# EasyEDA Pro project pcb_design.epro, board 控制板
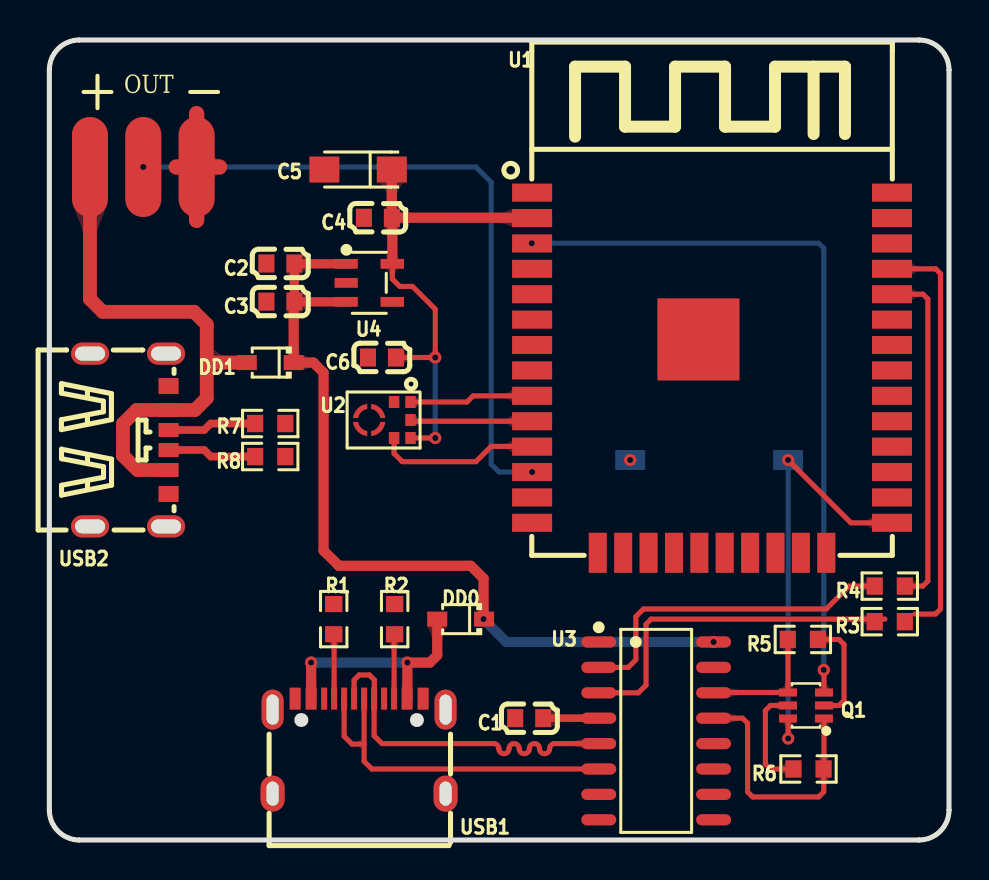
[diagram p2: board, top side]
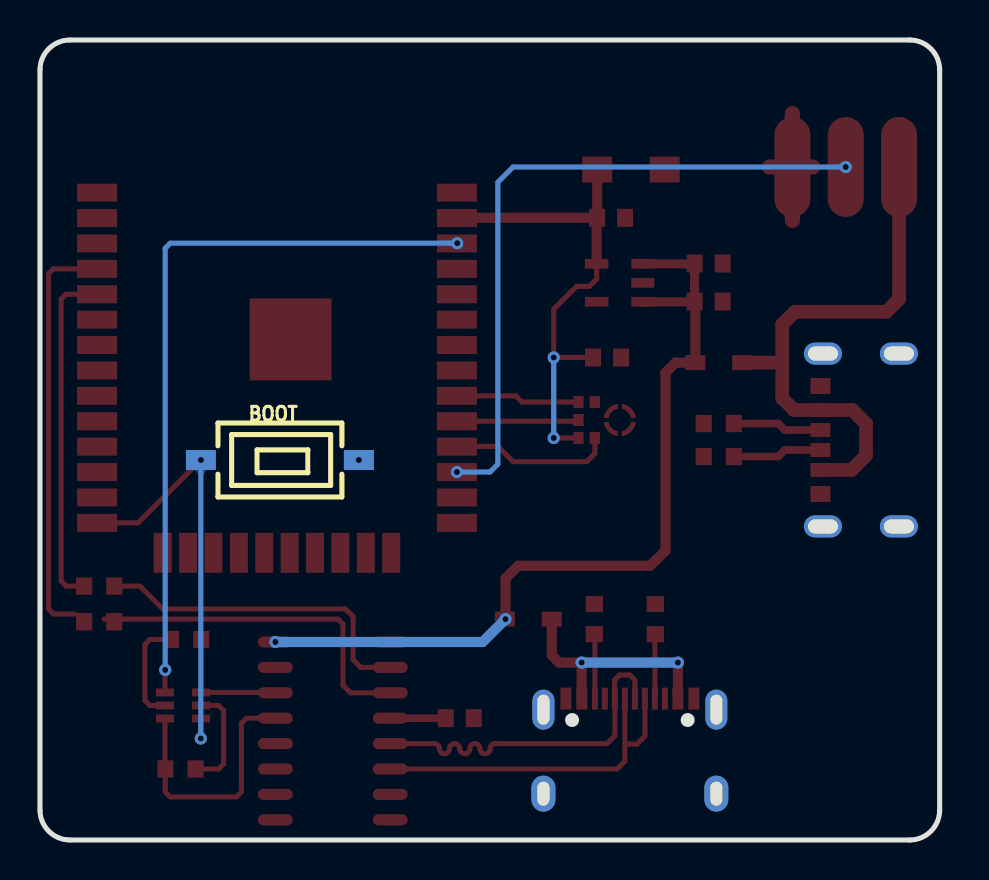
[diagram p3: board, bottom side, seen from below]

Outline 45 x 40 mm; copper layers: Top Layer, Bottom Layer. Coordinates in mm from the lower left corner of the outline.
Outline path: 0,38.5 0,1.5 arc(0.44,0.44) 1.5,0 43.5,0 arc(44.56,0.44) 45,1.5 45,38.5 arc(44.56,39.56) 43.5,40 1.5,40 arc(0.44,39.56) 0,38.5
Stack: Top Layer 0.035mm / Dielectric1 1.51mm FR4 er 4.5 / Bottom Layer 0.035mm

## Design rules (mm)
net D+: DP1
net D-: DP1
template: JLCPCB Capability(Two Layers Board)
spacing copperThickness1oz (default): track to track 0.102, other pairs 0.152 to 0.3
spacing copperThickness2oz: track to track 0.203, other pairs 0.152 to 0.3
track width copperThickness1oz (default): min 0.127, default 0.254, max 2.54
track width copperThickness2oz: min 0.203, default 0.254, max 2.54
differential pair differentialPair (default): width min 0.127, default 0.254, max 2.54; gap min 0.152, default 0.152
via viaSize (default): diameter min 0.5, default 0.61, max 10; hole min 0.3, default 0.305, max 6.3

## Placement (name value [footprint] x y rotation side)
BOOT  TS-1092S-B3D2-G  [SW-SMD_L6.1-W3.6-LS7.9]  33 19 0 bottom
C1  100nF  [C0603]  24 6.09 180 top
C2  1uF  [C0603]  11.56 28.82 0 top
C3  100nF  [C0603]  11.56 26.92 0 top
C4  100nF  [C0603]  16.43 31.11 0 top
C5  10uF  [CAP-SMD_L3.2-W1.6-RD]  15.44 33.52 180 top
C6  100nF  [C0603]  16.64 24.12 0 top
DD0  1N5819WS  [SOD-323_L1.8-W1.3-LS2.5-RD]  20.57 11.04 180 top
DD1  1N5819WS  [SOD-323_L1.8-W1.3-LS2.5-RD]  11.05 23.87 180 top
NOREF  -  [Pad_e70]  7.37 33.65 0 top
NOREF#2  -  [Pad_e33]  2.03 33.65 0 top
NOREF#3  -  [Pad_e47]  4.7 33.65 0 top
Q1  BC847BS  [SOT-363_L2.0-W1.3-P0.65-LS2.1-BR]  37.85 6.73 0 top
R1  5.1kΩ  [R0603]  14.22 11.04 90 top
R2  5.1kΩ  [R0603]  17.27 11.04 270 top
R3  100Ω  [R0603]  42.04 10.92 0 top
R4  100Ω  [R0603]  42.04 12.69 0 top
R5  10kΩ  [R0603]  37.69 10.03 0 top
R6  10kΩ  [R0603]  37.97 3.55 180 top
R7  5.1kΩ  [R0603]  11.05 20.82 180 top
R8  5.1kΩ  [R0603]  11.05 19.17 180 top
U1  ESP32-WROOM-32-N4  [WIFIM-SMD_ESP32-WROOM-32-N4]  33.15 23.36 0 top
U2  ICS-43434  [MIC-SMD_6P-L3.5-W2.7-P0.90-BL]  16.78 21 180 top
U3  CH340C  [SOP-16_L10.0-W3.9-P1.27-LS6.0-BL]  30.35 5.46 270 top
U4  SPX3819M5-L-3-3/TR  [SOT-23-5_L3.0-W1.7-P0.95-LS2.8-BL]  16 27.86 270 top
USB1  TYPE-C 16PIN 2MD(073)  [USB-C-SMD_TYPE-C-6PIN-2MD-073]  15.49 4.69 0 top
USB2  TYPE-C 6P(073)  [TYPE-C-SMD_TYPE-C-6P]  4 20 270 top

## Footprints (pads in the part's own frame, mm; a bottom-side part is the same pattern mirrored in y, then rotated)
C0603
  rect 0.8x0.9 smd: 1(-0.7,0) 2(0.7,0)
CAP-SMD_L3.2-W1.6-RD
  rect 1.5x1.296 smd: 1(-1.687,0) 2(1.687,0)
MIC-SMD_6P-L3.5-W2.7-P0.90-BL
  rect 0.52x0.6 smd: 1(-1.286,-0.9) 2(-0.465,-0.9) 4(-0.465,0.9) 5(-1.286,0.9) 6(-1.286,0)
  custom 0.709x0.71 smd: 3(0.276,-0.453) 3(0.329,0.505) 3(1.234,-0.505) 3(1.286,0.452)
Pad_e33
  oval 1.8x5 smd: 40(0,0)
Pad_e47
  oval 1.8x5 smd: 40(0,0)
Pad_e70
  oval 1.8x5 smd: 40(0,0)
R0603
  rect 0.806x0.864 smd: 1(-0.753,0) 2(0.753,0)
SOD-323_L1.8-W1.3-LS2.5-RD
  rect 1x0.75 smd: 1(-1.173,0) 2(1.173,0)
SOP-16_L10.0-W3.9-P1.27-LS6.0-BL
  oval 0.56x1.745 smd: 1(-4.445,-2.873) 2(-3.175,-2.873) 3(-1.905,-2.873) 4(-0.635,-2.873) 5(0.635,-2.873) 6(1.905,-2.873) 7(3.175,-2.873) 8(4.445,-2.873) 9(4.445,2.873) 10(3.175,2.873) 11(1.905,2.873) 12(0.635,2.873) 13(-0.635,2.873) 14(-1.905,2.873) 15(-3.175,2.873) 16(-4.445,2.873)
SOT-23-5_L3.0-W1.7-P0.95-LS2.8-BL
  rect 0.49x1.157 smd: 1(-0.95,-1.153) 2(0,-1.153) 3(0.95,-1.153)
  rect 0.49x1.175 smd: 4(0.95,1.153) 5(-0.95,1.153)
SOT-363_L2.0-W1.3-P0.65-LS2.1-BR
  rect 0.9x0.4 smd: 1(0.9,-0.65) 2(0.9,0) 3(0.9,0.65) 4(-0.9,0.65) 5(-0.9,0) 6(-0.9,-0.65)
SW-SMD_L6.1-W3.6-LS7.9
  rect 1.5x1 smd: 1(-3.95,0) 2(3.95,0)
TYPE-C-SMD_TYPE-C-6P
  oval 1.1x1.9 hole 0.7x1.5: 7(-4.32,1.837) 7(-4.32,-1.962) 7(4.32,1.837) 7(4.32,-1.962)
  rect 0.7x1 smd: A5(-0.5,1.962) A9(1.5,1.962) B5(0.5,1.962) B9(-1.5,1.962)
  rect 0.8x1 smd: A12(2.7,1.962) B12(-2.7,1.962)
USB-C-SMD_TYPE-C-6PIN-2MD-073
  rect 0.55x1.1 smd: 1(-3.2,2.375) 2(-2.4,2.375) 11(2.4,2.375) 12(3.2,2.375)
  rect 0.3x1.1 smd: 3(-1.75,2.375) 4(-1.25,2.375) 5(-0.75,2.375) 6(-0.25,2.375) 7(0.25,2.375) 8(0.75,2.375) 9(1.25,2.375) 10(1.75,2.375)
  oval 1.1x2 hole 0.6x1.5: 13(-4.325,1.825) 14(4.325,1.825)
  oval 1.2x1.8 hole 0.6x1.2: 13(-4.325,-2.375) 14(4.325,-2.375)
WIFIM-SMD_ESP32-WROOM-32-N4
  rect 2x0.9 smd: 1(-9,9.005) 2(-9,7.735) 3(-9,6.465) 4(-9,5.195) 5(-9,3.925) 6(-9,2.655) 7(-9,1.385) 8(-9,0.115) 9(-9,-1.155) 10(-9,-2.425) 11(-9,-3.695) 12(-9,-4.965) 13(-9,-6.235) 14(-9,-7.505) 25(9,-7.505) 26(9,-6.235) 27(9,-4.965) 28(9,-3.695) 29(9,-2.425) 30(9,-1.155) 31(9,0.115) 32(9,1.385) 33(9,2.655) 34(9,3.925) 35(9,5.195) 36(9,6.465) 37(9,7.735) 38(9,9.005)
  rect 0.9x2 smd: 15(-5.715,-9.005) 16(-4.445,-9.005) 17(-3.175,-9.005) 18(-1.905,-9.005) 19(-0.635,-9.005) 20(0.635,-9.005) 21(1.905,-9.005) 22(3.175,-9.005) 23(4.445,-9.005) 24(5.715,-9.005)
  rect 4.1x4.1 smd: 39(-0.68,1.665)

## Nets
As in the schematic, except:
GND: BOOT.1 C1.2 C3.1 C4.1 C5.2 C6.1 NOREF.40 R1.2 R2.1 R7.1 R8.1 U1.1 U1.15 U1.38 U1.39 U2.2 U2.3 U3.1 U4.2 USB1.1 USB1.12 USB1.13 USB1.14 USB2.7 USB2.A12 USB2.B12
DATA_IN: NOREF#3.40 U1.12
V_RGB: DD1.2 NOREF#2.40 USB2.A9 USB2.B9

Pads without a net: C2 1; U1 4 5 6 7 8 13 14 16 17 18 19 20 21 22 23 24 26 27 28 29 30 31 32 33 36 37; U3 7 8 9 10 11 12 15; U4 4; USB1 3 9

## Via types
v1: diameter 0.61, hole 0.305, Top Layer to Bottom Layer, 13 vias

## Routing (per net, layer and track width the routed paths; a pad name or vN(x,y) marks a point on that pad's centre or on a via; arc(x,y) is an arc through that point)
+3.3V: length 24.9
  Top Layer w0.254: U2.5 v1(19.3,20.1) ; U4.5 17.16,28.05 17.53,27.68 18.16,27.68 19.3,26.54 v1(19.3,24.12) C6.2
  Top Layer w0.508: U1.2 24.13,31.11 17.13,31.11 ; U4.5 17.16,31.09 C4.2 17.13,31.11 ; 17.13,31.11 C5.1
  Bottom Layer w0.254: v1(19.3,24.12) v1(19.3,20.1)
+5V: length 43.4
  Top Layer w0.457: U4.3 12.27,26.91 C3.2 C2.2 12.27,28.81 U4.1
  Top Layer w0.508: C3.2 12.22,26.88 DD1.1 13.21,23.87 13.72,23.36 13.72,14.47 14.48,13.71 21.08,13.71 21.72,13.08 21.72,11.07 DD0.1 v1(21.72,11.04)
  Bottom Layer w0.508: v1(21.72,11.04) 22.86,9.9 v1(33.23,9.9)
GND: length 7.5
  Top Layer w0.762: NOREF.40 6.35,33.65 ; NOREF.40 7.37,30.98 ; NOREF.40 7.37,36.32 ; NOREF.40 8.51,33.65
  vias: v1(29.05,19)
12S_SCK: length 8.2
  Top Layer w0.254: U2.4 17.24,19.33 17.65,18.92 21.34,18.92 22.1,19.68 24.13,19.68 U1.11
12S_SD: length 6.1
  Top Layer w0.254: U1.10 18.13,20.94 U2.6
12S_WS: length 6.2
  Top Layer w0.254: U2.1 20.89,21.9 21.2,22.21 U1.9
D+: length 18.1
  Top Layer w0.254: USB1.6 15.24,8 15.49,8.25 16.01,8.25 16.26,8 16.26,7.08 USB1.8 16.24,5.21 16.64,4.82 22.23,4.82 arc(22.41,4.75) 22.48,4.57 arc(22.74,4.31) 22.99,4.57 arc(23.25,4.82) 23.5,4.57 arc(23.75,4.31) 24.01,4.57 arc(24.26,4.82) 24.52,4.57 arc(24.77,4.31) 25.02,4.57 arc(25.1,4.75) 25.28,4.82 U3.5
D-: length 18.1
  Top Layer w0.254: 15.74,4.8 15.14,4.8 14.74,5.19 USB1.5 ; 15.74,4.8 15.74,3.94 16.13,3.55 U3.6 ; 15.74,4.8 USB1.7
DATA_IN: length 34
  Bottom Layer w0.254: v1(24.15,18.4) 22.49,18.4 22.1,18.79 22.1,32.89 21.34,33.65 v1(4.7,33.65)
EN: length 36.9
  Top Layer w0.254: v1(38.74,8.5) 38.75,8.49 Q1.3 ; U1.3 24.14,29.83 v1(24.13,29.84)
  Bottom Layer w0.254: v1(24.13,29.84) 38.48,29.84 38.74,29.59 v1(38.74,8.5)
IO0: length 21.4
  Top Layer w0.254: Q1.6 36.96,6.06 v1(36.96,5.08) ; U1.25 40.09,15.86 v1(36.95,19)
  Bottom Layer w0.254: v1(36.95,19) 36.96,18.99 v1(36.96,5.08)
RXD0: length 17.2
  Top Layer w0.254: R4.2 43.69,12.69 43.94,12.95 43.94,27.05 43.7,27.29 U1.34
TXD0: length 20.7
  Top Layer w0.254: U1.35 44.34,28.56 44.57,28.32 44.57,11.55 44.32,11.3 43.3,11.3
V_RGB: length 27.6
  Top Layer w0.686: USB2.A9 4.41,18.5 3.68,19.22 3.68,20.81 4.37,21.5 USB2.B9 7.28,21.5 7.87,22.09 7.87,23.87 ; 7.87,23.87 7.88,23.87 DD1.2 ; 7.87,23.87 7.87,25.78 7.24,26.41 2.67,26.41 2.03,27.05 NOREF#2.40
$1N5236: length 4.5
  Top Layer w0.381: USB2.A5 7.75,20.5 8.07,20.82 R7.2
$1N5237: length 4.5
  Top Layer w0.381: USB2.B5 7.75,19.5 8.07,19.17 R8.2
$1N5283: length 6.4
  Top Layer w0.254: U3.14 33.24,7.38 Q1.4 36.95,10.02 R5.1
$1N5284: length 12.9
  Top Layer w0.254: U3.13 34.67,6.09 34.93,5.84 34.93,2.41 35.18,2.15 38.48,2.15 38.74,2.41 38.74,3.54 R6.1 38.75,3.57 Q1.1
$1N5285: length 5.4
  Top Layer w0.254: Q1.5 36.07,6.73 35.81,6.47 35.81,3.81 36.07,3.55 R6.2
$1N5286: length 5.3
  Top Layer w0.254: R5.2 39.5,10.03 39.75,9.77 39.75,6.98 39.5,6.73 Q1.2
$1N5289: length 2.8
  Top Layer w0.381: U3.4 24.7,6.09
$1N5291: length 17.6
  Top Layer w0.254: U3.3 29.46,7.36 29.84,7.74 29.84,10.79 30.1,11.04 41.79,11.04
$1N5292: length 16.8
  Top Layer w0.254: U3.2 28.96,8.63 29.34,9.01 29.34,11.17 29.72,11.55 38.86,11.55 40,12.69 R4.1
$1N5300: length 11.9
  Top Layer w0.508: USB1.11 17.91,7.08 v1(17.91,8.87) 19.04,8.87 19.4,9.24 DD0.2 ; v1(13.09,8.87) USB1.2
  Bottom Layer w0.508: v1(13.09,8.87) v1(17.91,8.87)
$1N5301: length 3.2
  Top Layer w0.254: R1.1 14.24,10.27 USB1.4
$1N5302: length 3.2
  Top Layer w0.254: USB1.10 17.24,10.26 R2.2

## Copper pours and planes (outline as drawn; the poured copper is in the pictures)
GND on Top Layer: -2.67,43.68 47.62,43.68 47.62,-3.05 -2.67,-3.05
GND on Bottom Layer: -4.83,46.86 46.61,46.86 46.61,-5.09 -4.83,-5.09

Small or netless copper shapes (teardrops, artwork), in the pictures only: 85 on Top Layer, 9 on Bottom Layer

## Text on the board
Top Silkscreen Layer: + | - | OUT
